# EAGLE design noiseshield_v1a (EAGLE 5.11)
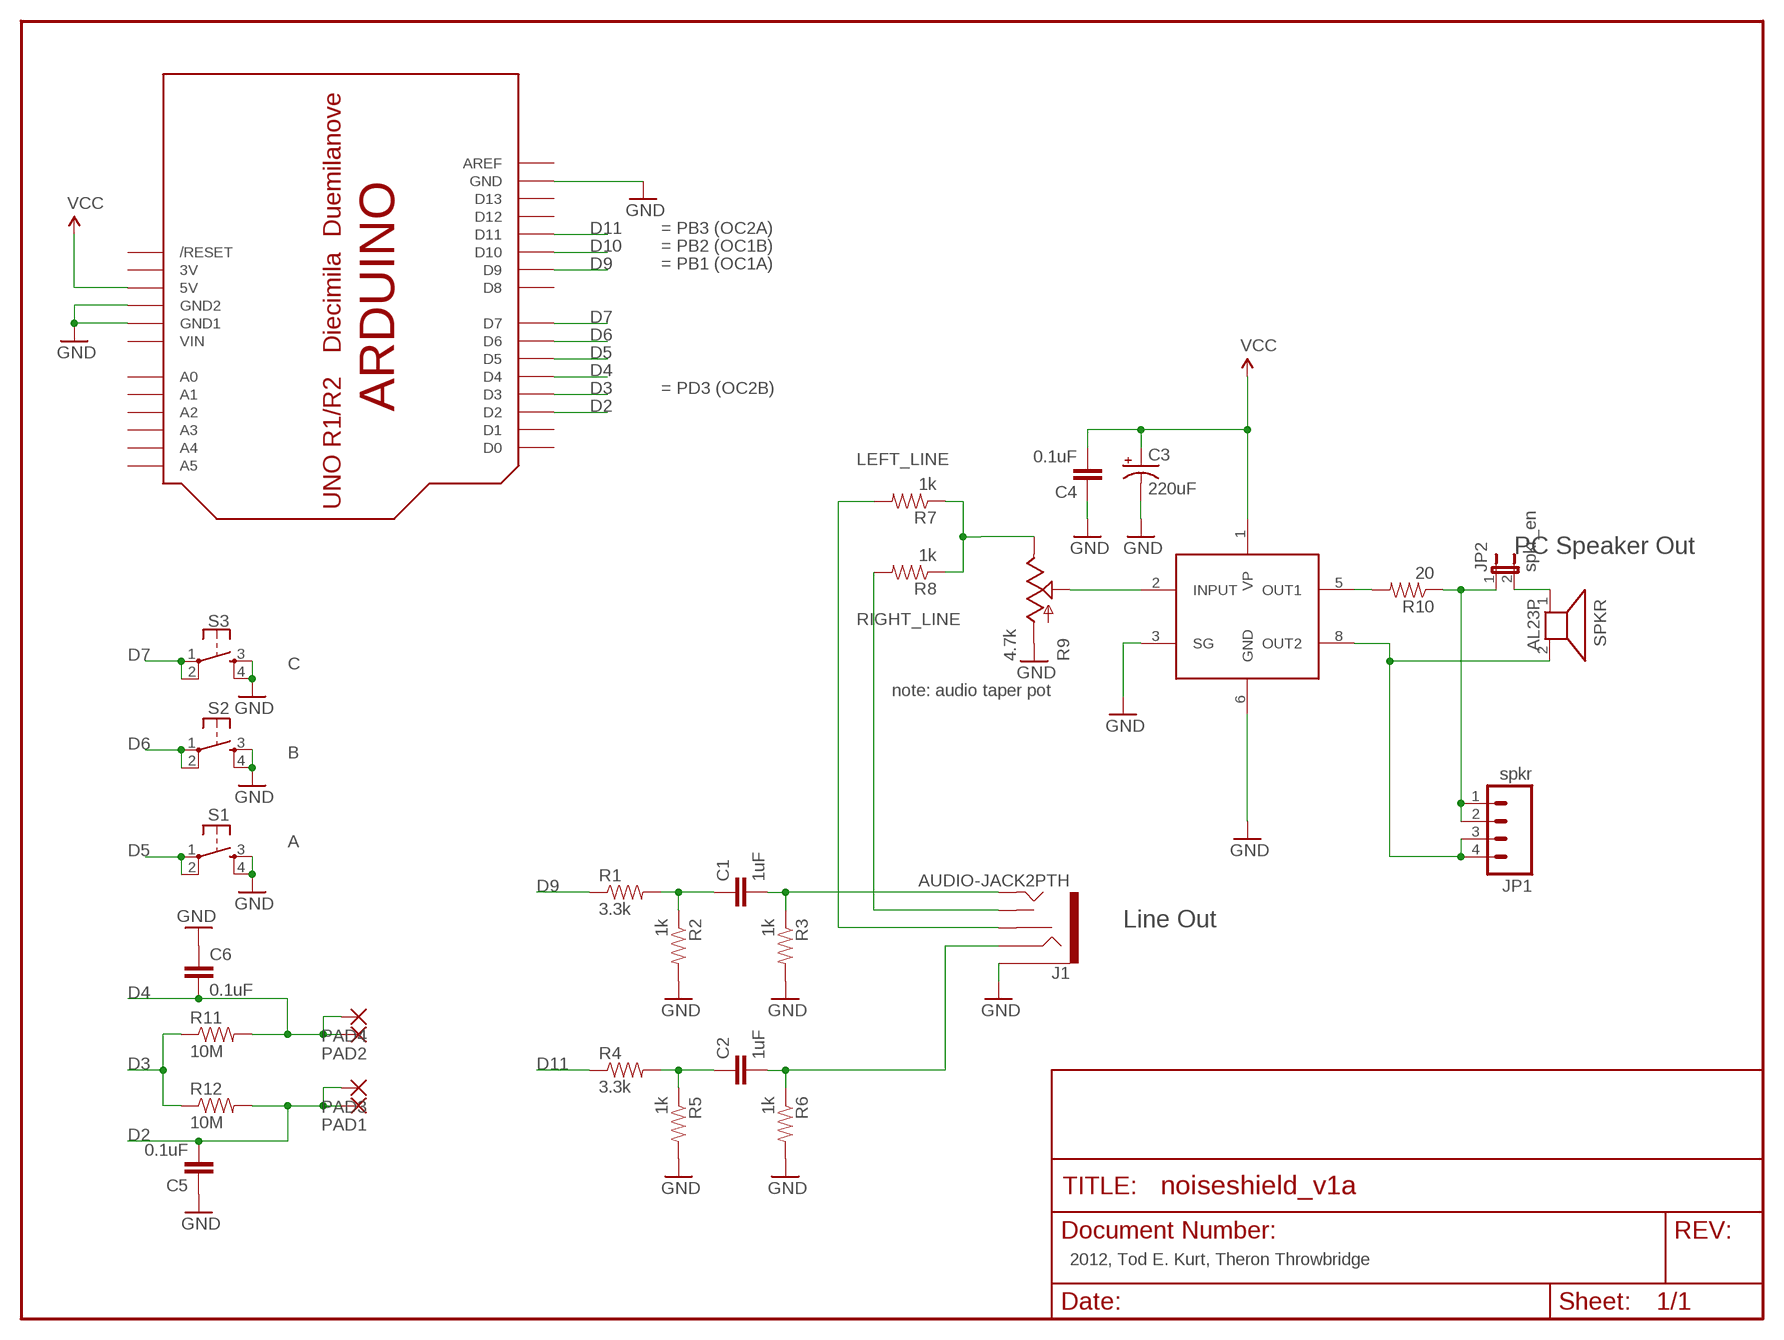
[diagram p0: schematic, sheet 1]

## Parts
C1  1uF  CAPPTH2  [CAP-PTH-SMALL2]
C2  1uF  CAPPTH2  [CAP-PTH-SMALL2]
C3  220uF  CAP_POLPTH1  [CPOL-RADIAL-100UF-25V]
C4  0.1uF  CAPPTH2  [CAP-PTH-SMALL2]
C5  0.1uF  CAPPTH2  [CAP-PTH-SMALL2]
C6  0.1uF  CAPPTH2  [CAP-PTH-SMALL2]
J1  AUDIO-JACK2PTH  [AUDIO-JACK]
JP1  spkr  M04LOCK  [1X04_LOCK]
JP2  spkr_en  JUMPER-2PTH  [1X02]
PAD1  WIREPADSMD5-2,5  [5-2,5]
PAD2  WIREPADSMD5-2,5  [5-2,5]
PAD3  WIREPADSMD5-2,5  [5-2,5]
PAD4  WIREPADSMD5-2,5  [5-2,5]
R1  3.3k  RESISTORKIT  [AXIAL-0.3-KIT]
R2  1k  RESISTORKIT  [AXIAL-0.3-KIT]
R3  1k  RESISTORKIT  [AXIAL-0.3-KIT]
R4  3.3k  RESISTORKIT  [AXIAL-0.3-KIT]
R5  1k  RESISTORKIT  [AXIAL-0.3-KIT]
R6  1k  RESISTORKIT  [AXIAL-0.3-KIT]
R7  1k  RESISTORKIT  [AXIAL-0.3-KIT]
R8  1k  RESISTORKIT  [AXIAL-0.3-KIT]
R9  4.7k  POT  [ALPS_POT]
R10  20  RESISTORKIT  [AXIAL-0.3-KIT]
R11  10M  RESISTORKIT  [AXIAL-0.3-KIT]
R12  10M  RESISTORKIT  [AXIAL-0.3-KIT]
S1  A  TAC_SWITCHPTH  [TACTILE-PTH]
S2  B  TAC_SWITCHPTH  [TACTILE-PTH]
S3  C  TAC_SWITCHPTH  [TACTILE-PTH]
SPKR  AL23P  [AL23P]
U1  TDA7052  [DIL08]
U$1  ARDUINO-BPLACE  [ARDUINO-BPLACE]

## Nets
D2: C5.2 PAD1.1(P) PAD3.1(P) R12.P$2 U$1.D2
D3: R11.P$1 R12.P$1 U$1.D3
D4: C6.2 PAD2.1(P) PAD4.1(P) R11.P$2 U$1.D4
D5: S1.1 S1.2 U$1.D5
D6: S2.1 S2.2 U$1.D6
D7: S3.1 S3.2 U$1.D7
D9: R1.P$1 U$1.D9
D10: U$1.D10
D11: R4.P$1 U$1.D11
GND: C3.2(-) C4.1 C5.1 C6.1 J1.SLEEVE R2.P$2 R3.P$2 R5.P$2 R6.P$2 R9.P$3(A) S1.3 S1.4 S2.3 S2.4 S3.3 S3.4 U1.3(SG) U1.6(GND) U$1.GND U$1.GND1 U$1.GND2
LEFT_LINE: J1.RSH R7.P$2
N$1: C1.1 R1.P$2 R2.P$1
N$2: C1.2 J1.TIP R3.P$1
N$3: JP1.3 JP1.4 SPKR.2 U1.8(OUT2)
N$4: C2.1 R4.P$2 R5.P$1
N$5: R10.P$2 U1.5(OUT1)
N$7: C2.2 J1.RING R6.P$1
N$8: JP1.1 JP1.2 JP2.1 R10.P$1
N$10: JP2.2 SPKR.1
N$11: R7.P$1 R8.P$1 R9.P$1(E)
R10: R9.P$2(S) U1.2(INPUT)
RIGHT_LINE: J1.TSH R8.P$2
VCC: C3.1(+) C4.2 U1.1(VP) U$1.5V
Unconnected: U$1.A0 U$1.A1 U$1.A2 U$1.A3 U$1.A4 U$1.A5 U$1.AREF U$1.D0 U$1.D1 U$1.D8 U$1.D12 U$1.D13 U$1.RESET(/RESET)

## Notes on the sheet
- = PB3 (OC2A)
- = PB2 (OC1B)
- = PB1 (OC1A)
- = PD3 (OC2B)
- PC Speaker Out
- note: audio taper pot
- Line Out
- 2012, Tod E. Kurt, Theron Throwbridge

## Power pins joined to a net without a drawn wire
3V: U$1.3V
VIN: U$1.VIN

## Library data of the parts
C1 C2 C4-C6 = SparkFun-20110517:CAP: Capacitor Standard 0603 ceramic capacitor, and 0.1" leaded capacitor.
C3 = SparkFun-20110517:CAP_POL: Capacitor Polarized These are standard SMD and PTH capacitors. Normally 10uF, 47uF, and 100uF in electrolytic and tantalum varieties. Always verify the external diameter of the through hole cap, it varies with capacity, voltage, and manufacturer. The EIA devices should be standard.
J1 = SparkFun-20110517:AUDIO-JACK2
JP1 = SparkFun-20110517:M04: Header 4 Standard 4-pin 0.1" header. Use with straight break away headers (SKU : PRT-00116), right angle break away headers (PRT-00553), swiss pins (PRT-00743), machine pins (PRT-00117), and female headers (PRT-00115). Molex polarized connector foot print use with SKU : PRT-08231 with associated crimp pins and housings. 1MM SMD Version SKU: PRT-10208
JP2 = SparkFun-20110517:JUMPER-2: Jumper Basic 0.1" spaced jumper. Use with breakaway headers.
PAD1-PAD4 = wirepad:WIREPAD: Wire PAD connect wire on PCB
R1-R8 R10-R12 = SparkFun-20110517:RESISTOR: Resistor Basic schematic elements and footprints for 0603, 1206, and PTH resistors.
R9 = SparkFun-20110517:POT
S1-S3 = SparkFun-20110517:TAC_SWITCH: Momentary Switch Button commonly used for reset or general input. Spark Fun Electronics SKU : COM-00097
SPKR = buzzer:AL23P: SPEAKER Source: Buerklin; OC_FARNELL: unknown; OC_NEWARK: unknown
U1 = tda7052:TDA7052: 1W Mono audio amplifier
U$1 = adafruit-20120122:ARDUINO: Arduino Diecimila/Duemilanove Make a shield with ease, this package has all the named pins as well as the two mounting drill holes and an outline of the USB and DC power connector. The outline is on the DIMENSION layer, so if your board house uses it they will cut the outline to match. http://www.ladyada.net/library/pcb/eaglelibrary.html

## Board
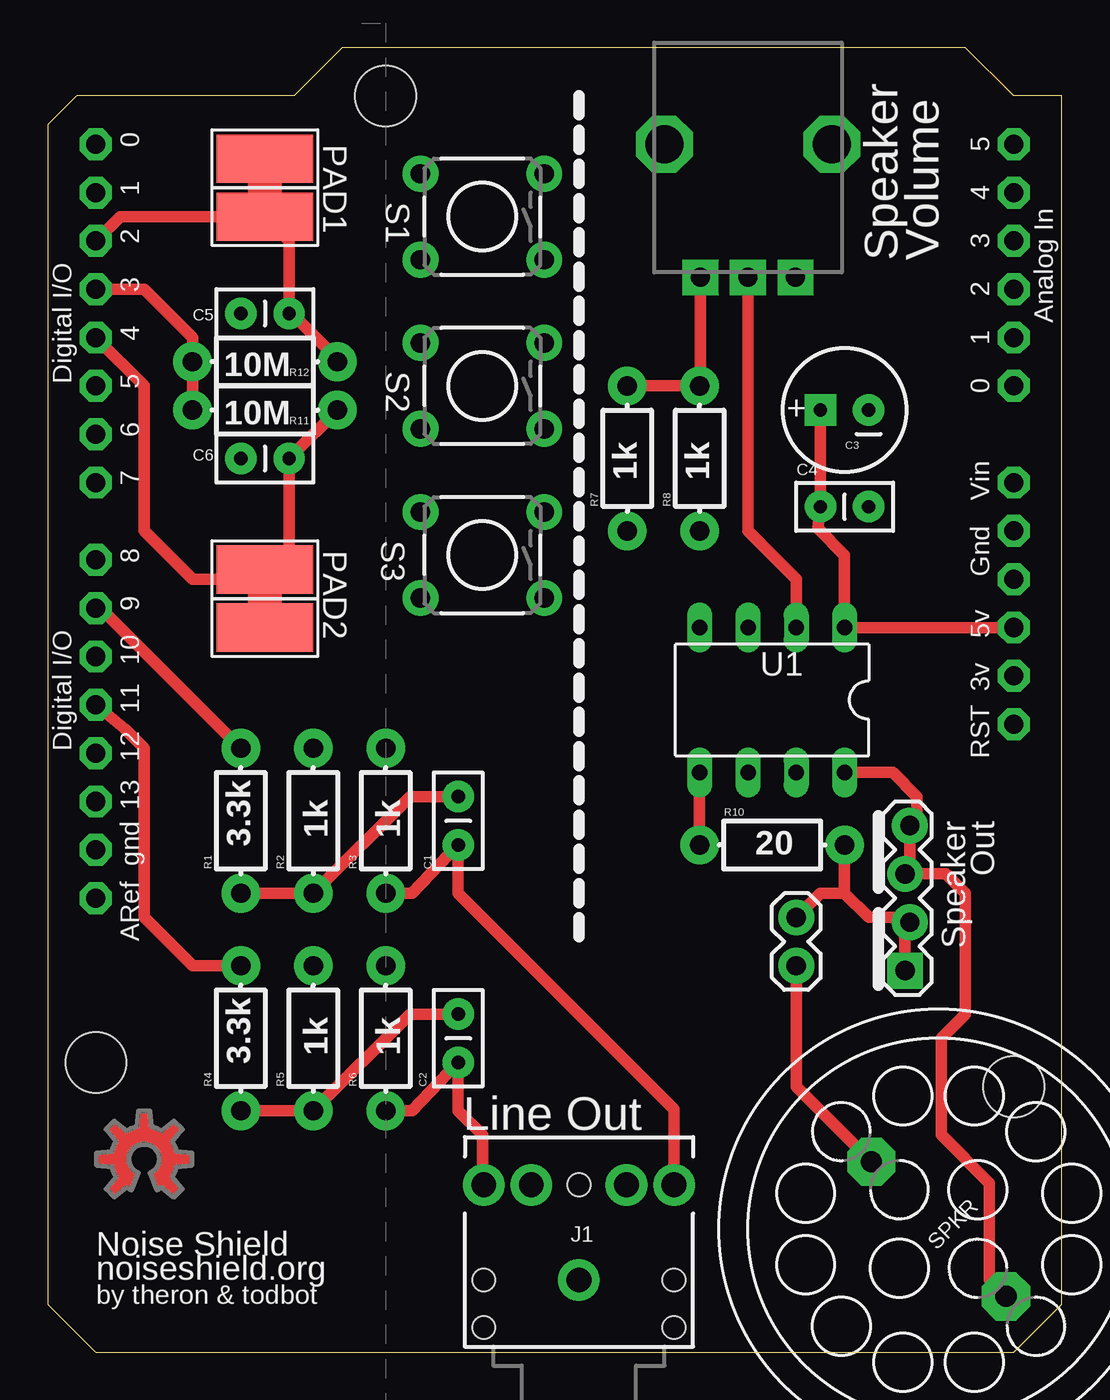
[diagram p1: board, top side]
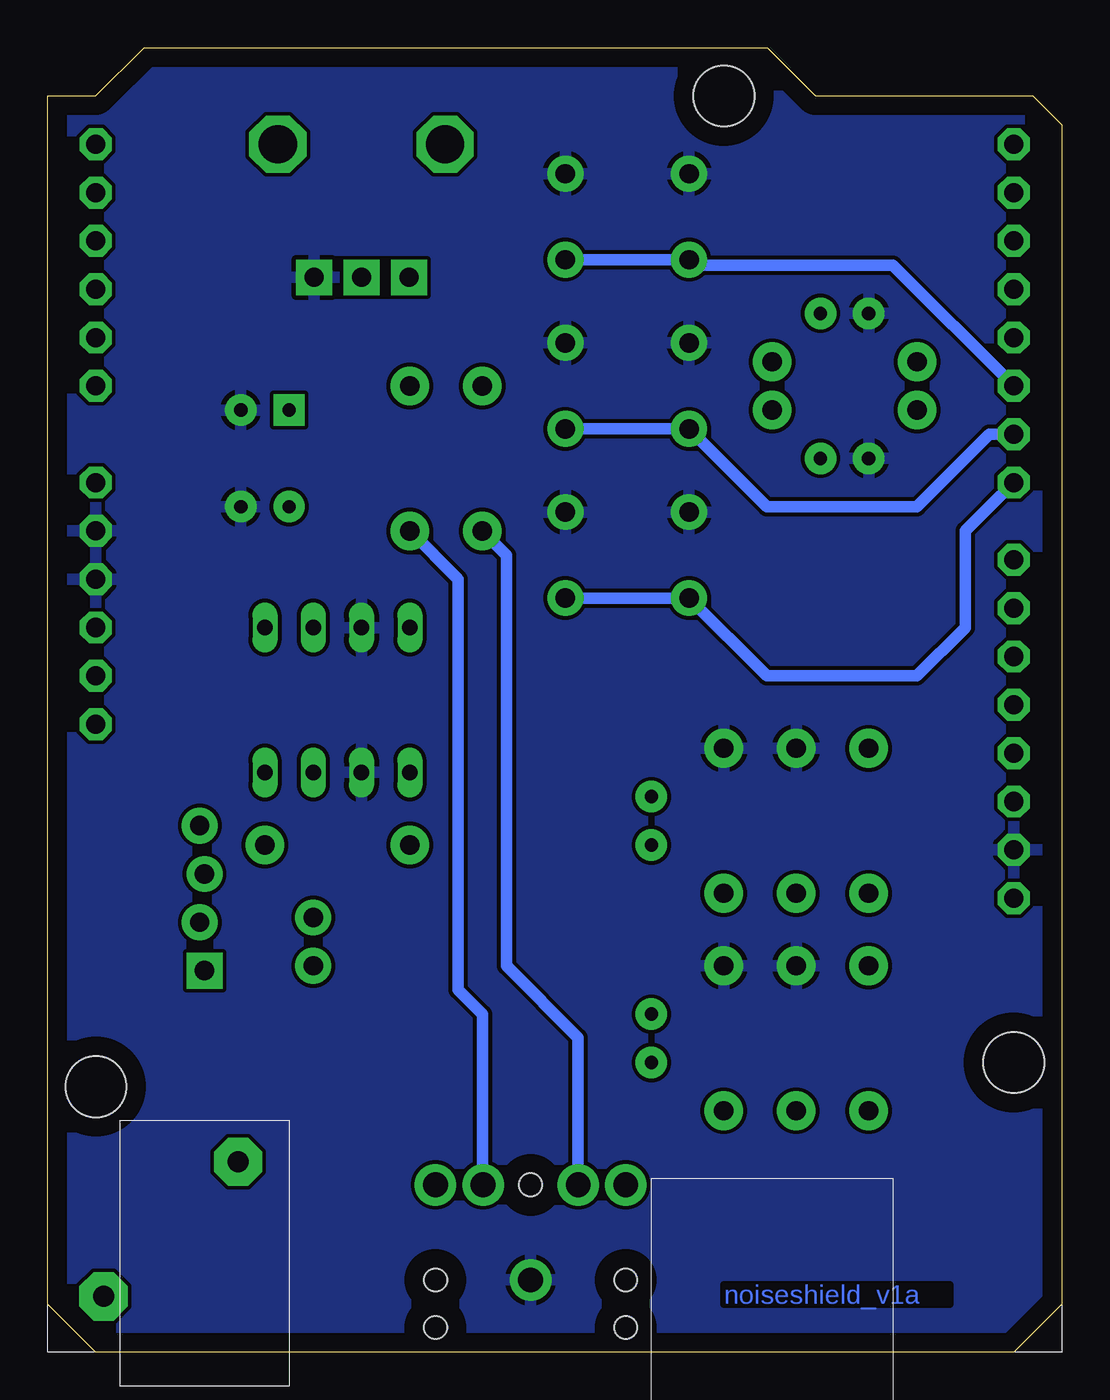
[diagram p2: board, bottom side, seen from below]

Size 53.34 x 68.58 mm. Coordinates in mm from the lower left corner, seen from the top.
Outline: 2.54,0 50.8,0 53.34,2.54 53.34,66.04 50.8,66.04 48.26,68.58 15.49,68.58 12.95,66.04 1.52,66.04 0,64.52 0,2.54 2.54,0
Copper layers (1*16): Top 0.035mm / dielectric 1.5mm / Bottom 0.035mm
Design rules "default": minimum track width 10mil, minimum drill 24mil, track to track 8mil, track to pad 8mil, pad to pad 8mil, via to via 8mil, smd to smd 8mil, copper to edge 40mil, drill to drill 8mil, minimum pad ring 10mil, minimum via ring 8mil, stop-mask expansion 4mil, vias tented up to drill 0mil, thermal gap 10mil

### Footprints (pad centres in the part's own frame; a part is rotated, then mirrored left to right if it is on the bottom)
CAP-PTH-SMALL2 = drill 0.7 pad 1.651 round: 1 0,0; 2 2.54,0
CPOL-RADIAL-100UF-25V = drill 0.7 pad 1.651 square: 1 1.27,0 | drill 0.7 pad 1.651 round: 2 -1.27,0
AUDIO-JACK = drill 1.3 pad 2.184 round: RING 5,5; RSH 5,2.5; SLEEVE 0,0; TIP 5,-5; TSH 5,-2.5 | hole 1.2: 0,5; -2.5,5; -2.5,-5; 0,-5; 5,0
1X04_LOCK = drill 1.016 pad 1.88 square: 1 0,0.127 | drill 1.016 pad 1.88 round: 2 2.54,-0.127; 3 5.08,0.127; 4 7.62,-0.127
1X02 = drill 1.016 pad 1.88 round: 1 0,0; 2 2.54,0
5-2,5 = smd 2.54 x 5.08: 1 0,0
AXIAL-0.3-KIT = drill 1.016 pad 2.032 round: P$1 -3.81,0; P$2 3.81,0
ALPS_POT = drill 1 pad 1.88 square: P$1 7,-2.5; P$2 7,0; P$3 7,2.5 | drill 2 octagon: P$4 0,-4.4; P$5 0,4.4
TACTILE-PTH = drill 1.016 pad 1.88 round: 1 -3.251,2.261; 2 3.251,2.261; 3 -3.251,-2.261; 4 3.251,-2.261
AL23P = drill 1.118 pad 2.54 octagon: 1 -5.004,0; 2 5.004,0
DIL08 = drill 0.813 long: 1 -3.81,-3.81; 2 -1.27,-3.81; 3 1.27,-3.81; 4 3.81,-3.81; 5 3.81,3.81; 6 1.27,3.81; 7 -1.27,3.81; 8 -3.81,3.81
ARDUINO-BPLACE = drill 1 pad 1.676 octagon: 3V 35.56,2.54; 5V 38.1,2.54; A0 50.8,2.54; A1 53.34,2.54; A2 55.88,2.54; A3 58.42,2.54; A4 60.96,2.54; A5 63.5,2.54; AREF 23.876,50.8; D0 63.5,50.8; D1 60.96,50.8; D2 58.42,50.8; D3 55.88,50.8; D4 53.34,50.8; D5 50.8,50.8; D6 48.26,50.8; D7 45.72,50.8; D8 41.656,50.8; D9 39.116,50.8; D10 36.576,50.8; D11 34.036,50.8; D12 31.496,50.8; D13 28.956,50.8; GND 26.416,50.8; GND1 43.18,2.54; GND2 40.64,2.54; RESET 33.02,2.54; VIN 45.72,2.54 | hole 3.2: 15.24,50.8; 66.04,35.56; 13.97,2.54

### Placement (x,y rotation side)
C1  21.59,29.21 270 top
C2  21.59,17.78 270 top
C3  41.91,49.53 180 top
C4  43.18,44.45 180 top
C5  10.16,54.61 0 top
C6  10.16,46.99 0 top
J1  27.94,3.81 90 top
JP1  45.21,20.07 90 top
JP2  39.37,22.86 270 top
PAD1  11.43,59.69 90 top
PAD2  11.43,41.15 270 top
PAD3  11.43,62.74 270 top
PAD4  11.43,38.1 90 top
R1  10.16,27.94 270 top
R2  13.97,27.94 90 top
R3  17.78,27.94 90 top
R4  10.16,16.51 270 top
R5  13.97,16.51 90 top
R6  17.78,16.51 90 top
R7  30.48,46.99 270 top
R8  34.29,46.99 270 top
R9  36.83,63.5 270 top
R10  38.1,26.67 180 top
R11  11.43,49.53 0 top
R12  11.43,52.07 0 top
S1  22.86,59.69 180 top
S2  22.86,50.8 180 top
S3  22.86,41.91 180 top
SPKR  46.85,6.49 315 top
U1  38.1,34.29 180 top
U$1  53.34,0 90 top
U$3  [OSHWLOGO_TOP_0.2]  5.08,10.16 0 top

### Tracks (layer width: path | path; a pad name or v marks a point on that pad's centre or on a via)
D2
  Top 0.61: R12.P$2 15.24,52.2 12.83,54.61 C5.2 12.7,58.42 PAD1.1 3.81,59.69 U$1.D2
  Top 1.778: PAD1.1 PAD3.1
D3
  Top 0.61: R11.P$1 R12.P$1 7.62,53.34 5.08,55.88 U$1.D3
D4
  Top 0.61: R11.P$2 12.83,47.12 C6.2 12.7,41.91 11.43,40.64 | 11.43,40.64 PAD2.1 | U$1.D4 5.08,50.8 5.08,43.18 7.62,40.64 11.43,40.64
  Top 1.778: PAD4.1 11.43,40.64 PAD2.1
D5
  Bottom 0.61: S1.1 S1.2 19.33,57.15 8.89,57.15 U$1.D5
D6
  Bottom 0.61: U$1.D6 3.81,48.26 7.62,44.45 15.52,44.45 S2.2 S2.1
D7
  Bottom 0.61: S3.1 S3.2 15.52,35.56 7.62,35.56 5.08,38.1 5.08,43.18 3.81,44.45 U$1.D7
D9
  Top 0.61: U$1.D9 2.79,39.12 5.08,36.83 R1.P$1
D11
  Top 0.61: U$1.D11 4.06,32.77 5.08,31.75 5.08,22.86 7.62,20.32 R4.P$1
GND
  pour Bottom: 0,0 54.61,-1.27 53.34,68.58 -1.27,69.85
LEFT_LINE
  Bottom 0.61: R7.P$2 29.21,41.91 29.21,20.32 25.44,16.55 J1.RSH
N$1
  Top 0.61: R1.P$2 R2.P$1 19.05,29.21 C1.1
N$2
  Top 0.61: C1.2 19.18,24.13 R3.P$1 | C1.2 21.72,26.54 | J1.TIP 32.94,12.78 21.59,24.13 C1.2
N$3
  Top 0.61: U1.8 44.45,30.48 45.72,29.21 45.72,28.07 JP1.4 45.34,25.4 JP1.3 47.24,25.15 48.26,24.13 48.26,17.78 46.99,16.51 46.99,11.43 49.53,8.89 49.53,3.81 SPKR.2
N$4
  Top 0.61: R4.P$2 R5.P$1 19.05,17.78 C2.1
N$5
  Top 0.61: R10.P$2 U1.5
N$7
  Top 0.61: R6.P$1 19.18,12.7 C2.2 21.59,12.7 22.86,11.43 22.86,8.89 J1.RING
N$8
  Top 0.61: JP1.1 45.09,22.35 JP1.2 45.09,22.86 43.18,22.86 41.91,24.13 | 41.91,24.13 R10.P$1 | 41.91,24.13 40.64,24.13 JP2.1
N$10
  Top 0.61: JP2.2 39.37,13.97 SPKR.1
N$11
  Top 0.61: R8.P$1 R7.P$1 34.33,50.8 R9.P$1
R10
  Top 0.61: U1.2 39.37,40.64 36.83,43.18 36.83,52.07 36.83,53.34 R9.P$2
RIGHT_LINE
  Bottom 0.61: R8.P$2 31.75,40.64 31.75,30.48 31.75,20.32 31.75,19.05 30.48,17.78 30.48,8.85 J1.TSH
VCC
  Top 0.61: U$1.5V 43.18,38.1 U1.1 41.91,41.91 40.51,43.31 C4.2 40.64,44.58 C3.1

### Text on the board
Bottom: noiseshield_v1a
tPlace: Speaker | Volume | + | Speaker | Out | Line Out | Noise Shield | noiseshield.org | by theron & todbot